# EAGLE schematic Wordclock-main-xtended (EAGLE 6.3)
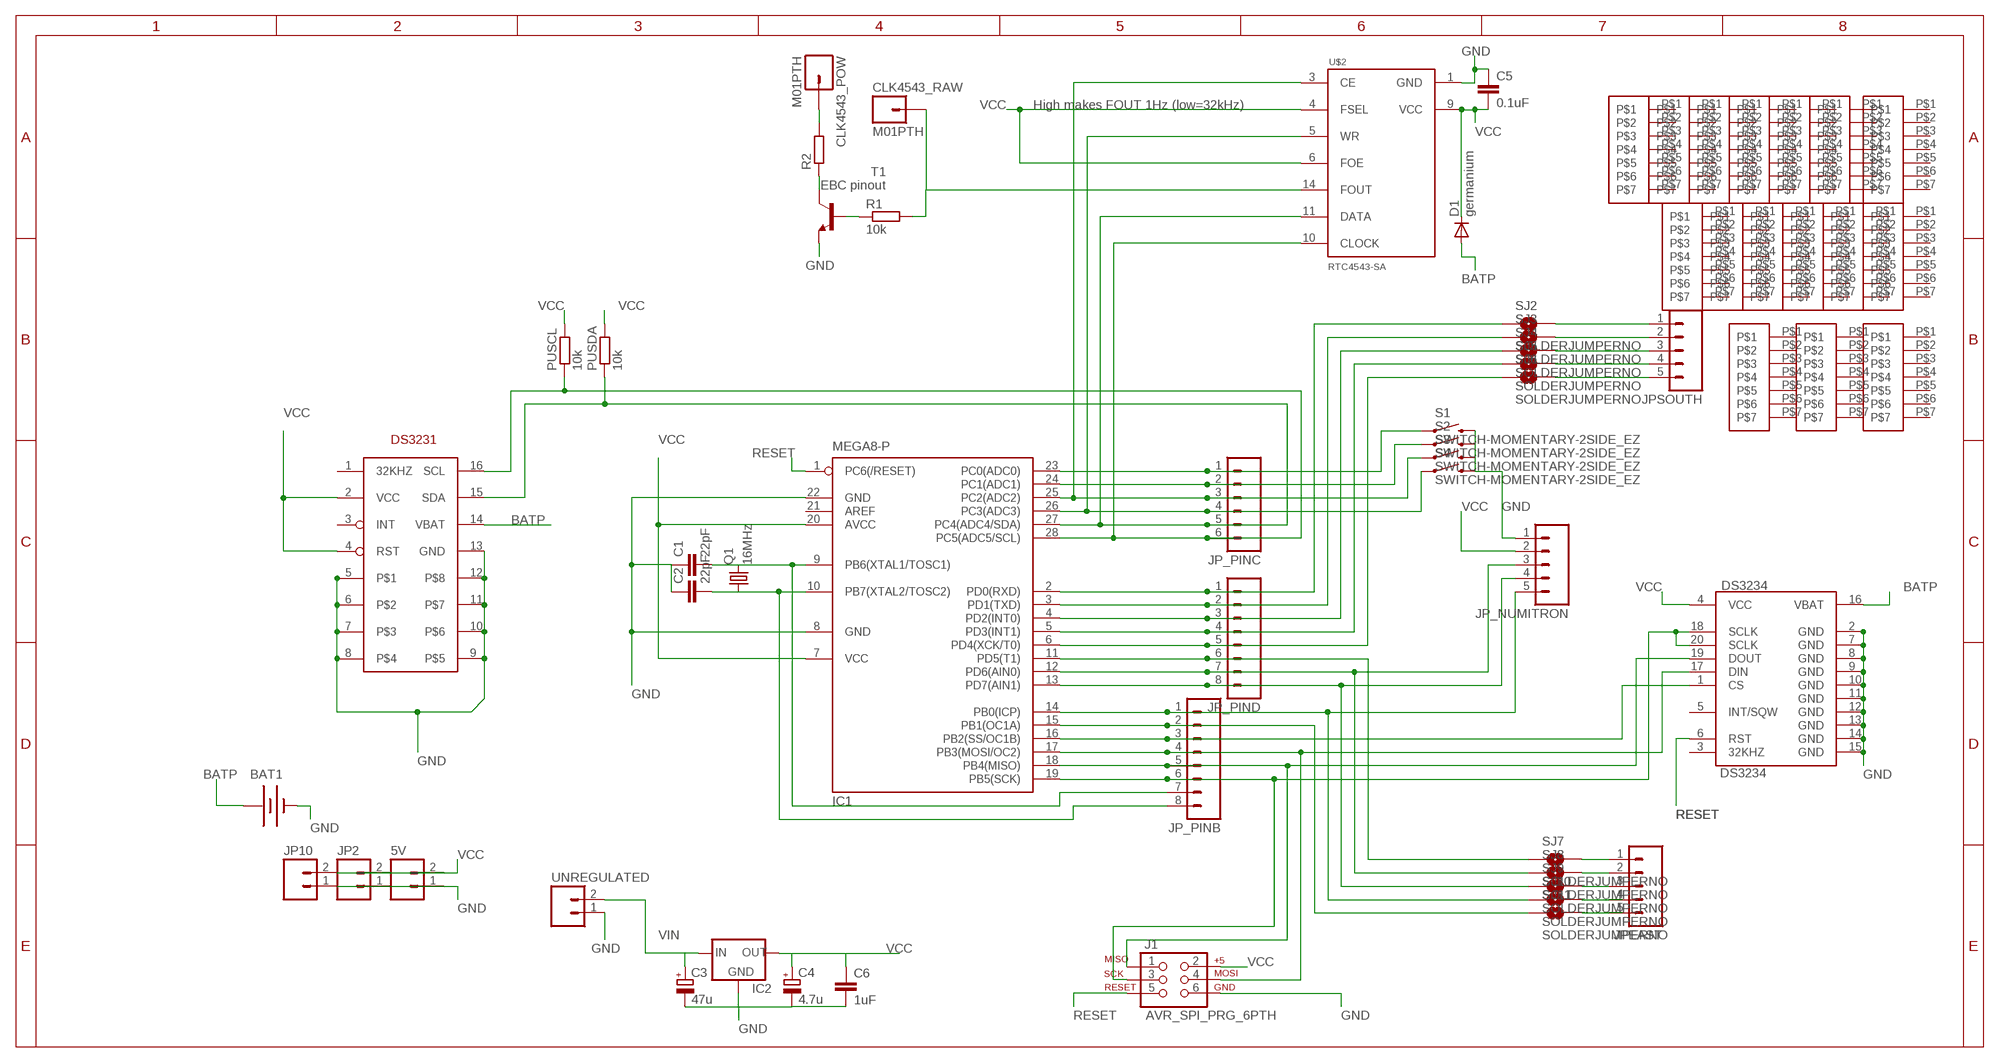
[diagram p0: schematic, sheet 1]

## Parts
5V  M02PTH3  [1X02_LONGPADS]
BAT1  BATTERY20PTH  [BATTCOM_20MM_PTH]
C1  22pF  C-EU025-024X044  [C025-024X044]
C2  22pF  C-EU025-024X044  [C025-024X044]
C3  47u  CPOL-EUE2,5-6E  [E2,5-6E]
C4  4.7u  CPOL-EUE2,5-6E  [E2,5-6E]
C5  0.1uF  C-EU025-024X044  [C025-024X044]
C6  1uF  C-EU025-024X044  [C025-024X044]
CLK4543_POW  M01PTH  [1X01]
CLK4543_RAW  M01PTH  [1X01]
D1  germanium  DIODE-D-7.5  [D-7.5]
DS3234  DS3234  [DS3234]
IC1  MEGA8-P  [DIL28-3]
IC2  V_REG_78XXSIDE  [78XXL]
J1  AVR_SPI_PRG_6PTH  [2X3]
JP1  M7_NOSILK  [M7_NOSILK]
JP2  M02PTH3  [1X02_LONGPADS]
JP3  M7_NOSILK  [M7_NOSILK]
JP4  M7_NOSILK  [M7_NOSILK]
JP5  M7_NOSILK  [M7_NOSILK]
JP6  M7_NOSILK  [M7_NOSILK]
JP7  M7_NOSILK  [M7_NOSILK]
JP8  M7_NOSILK  [M7_NOSILK]
JP9  M7_NOSILK  [M7_NOSILK]
JP10  M02PTH3  [1X02_LONGPADS]
JP_NUMITRON  M05PTH  [1X05]
JP_PINB  M081X08  [1X08]
JP_PINC  M06SIP  [1X06]
JP_PIND  M081X08  [1X08]
JPEAST  M05PTH  [1X05]
JPSOUTH  M05PTH  [1X05]
PUSCL  10k  R-EU_0204/5  [0204/5]
PUSDA  10k  R-EU_0204/5  [0204/5]
Q1  16MHz  CRYSTALHC49S  [HC49/S]
R1  10k  R-EU_0204/5  [0204/5]
R2  R-EU_0204/5  [0204/5]
S1  SWITCH-MOMENTARY-2SIDE_EZ  [TACTILE-PTH-SIDEEZ]
S2  SWITCH-MOMENTARY-2SIDE_EZ  [TACTILE-PTH-SIDEEZ]
S3  SWITCH-MOMENTARY-2SIDE_EZ  [TACTILE-PTH-SIDEEZ]
S4  SWITCH-MOMENTARY-2SIDE_EZ  [TACTILE-PTH-SIDEEZ]
SJ2  SOLDERJUMPERNO  [SJ_2S-NO]
SJ3  SOLDERJUMPERNO  [SJ_2S-NO]
SJ4  SOLDERJUMPERNO  [SJ_2S-NO]
SJ5  SOLDERJUMPERNO  [SJ_2S-NO]
SJ6  SOLDERJUMPERNO  [SJ_2S-NO]
SJ7  SOLDERJUMPERNO  [SJ_2S-NO]
SJ8  SOLDERJUMPERNO  [SJ_2S-NO]
SJ9  SOLDERJUMPERNO  [SJ_2S-NO]
SJ10  SOLDERJUMPERNO  [SJ_2S-NO]
SJ11  SOLDERJUMPERNO  [SJ_2S-NO]
T1  EBC pinout  -NPN-TO92-EBC  [TO92-EBC]
U$1  DS3231DS3231-SO16W  [SO16W]
U$2  RTC4543-SA  [SOP14]
U$3  M7_NOSILK  [M7_NOSILK]
U$4  M7_NOSILK  [M7_NOSILK]
U$5  M7_NOSILK  [M7_NOSILK]
U$6  M7_NOSILK  [M7_NOSILK]
U$7  M7_NOSILK  [M7_NOSILK]
U$8  M7_NOSILK  [M7_NOSILK]
U$9  M7_NOSILK  [M7_NOSILK]
U$10  M7_NOSILK  [M7_NOSILK]
UNREGULATED  M02PTH3  [1X02_LONGPADS]

## Nets
BATP: BAT1.1(+) D1.A DS3234.16(VBAT) U$1.14(VBAT)
GND: 5V.1 BAT1.2(-) C1.1 C2.1 C3.- C4.- C5.1 C6.2 DS3234.2(GND) DS3234.7(GND) DS3234.8(GND) DS3234.9(GND) DS3234.10(GND) DS3234.11(GND) DS3234.12(GND) DS3234.13(GND) DS3234.14(GND) DS3234.15(GND) IC1.8(GND) IC1.22(GND) IC2.GND J1.6 JP2.1 JP10.1 JP_NUMITRON.1 S1.2 S2.2 S3.2 S4.2 T1.E U$1.5 U$1.6 U$1.7 U$1.8 U$1.9 U$1.10 U$1.11 U$1.12 U$1.13(GND) U$2.1(GND) UNREGULATED.1
N$1: IC1.23(PC0(ADC0)) JP_PINC.1 S1.1
N$2: IC1.24(PC1(ADC1)) JP_PINC.2 S2.1
N$3: JPEAST.1 SJ7.2
N$4: C1.2 IC1.9(PB6(XTAL1/TOSC1)) JP_PINB.7 Q1.2
N$5: C2.2 IC1.10(PB7(XTAL2/TOSC2)) JP_PINB.8 Q1.1
N$6: DS3234.1(CS) IC1.16(PB2(SS/OC1B)) JP_PINB.3
N$7: IC1.25(PC2(ADC2)) JP_PINC.3 S3.1 U$2.3(CE)
N$8: JPEAST.2 SJ8.2
N$9: JPEAST.3 SJ9.2
N$10: JPEAST.4 SJ10.2
N$11: JPEAST.5 SJ11.2
N$12: DS3234.18(SCLK) DS3234.20(SCLK) IC1.19(PB5(SCK)) J1.3 JP_PINB.6
N$13: DS3234.19(DOUT) IC1.18(PB4(MISO)) J1.1 JP_PINB.5
N$14: DS3234.17(DIN) IC1.17(PB3(MOSI/OC2)) J1.4 JP_PINB.4
N$15: JPSOUTH.1 SJ2.2
N$16: JPSOUTH.2 SJ3.2
N$17: JPSOUTH.3 SJ4.2
N$18: JPSOUTH.4 SJ5.2
N$19: JPSOUTH.5 SJ6.2
N$20: IC1.2(PD0(RXD)) JP_PIND.1 SJ2.1
N$21: IC1.3(PD1(TXD)) JP_PIND.2 SJ3.1
N$22: IC1.4(PD2(INT0)) JP_PIND.3 SJ4.1
N$23: IC1.5(PD3(INT1)) JP_PIND.4 SJ5.1
N$24: IC1.6(PD4(XCK/T0)) JP_PIND.5 SJ6.1
N$25: IC1.15(PB1(OC1A)) JP_PINB.2 SJ11.1
N$26: IC1.14(PB0(ICP)) JP_NUMITRON.5 JP_PINB.1 SJ10.1
N$27: IC1.13(PD7(AIN1)) JP_NUMITRON.4 JP_PIND.8 SJ9.1
N$28: IC1.12(PD6(AIN0)) JP_NUMITRON.3 JP_PIND.7 SJ8.1
N$29: IC1.11(PD5(T1)) JP_PIND.6 SJ7.1
N$30: IC1.28(PC5(ADC5/SCL)) JP_PINC.6 PUSCL.1 U$1.16(SCL) U$2.10(CLOCK)
N$31: IC1.27(PC4(ADC4/SDA)) JP_PINC.5 PUSDA.1 U$1.15(SDA) U$2.11(DATA)
N$32: IC1.26(PC3(ADC3)) JP_PINC.4 S4.1 U$2.5(WR)
N$33: CLK4543_RAW.1 R1.2 U$2.14(FOUT)
N$34: R1.1 T1.B
N$35: R2.1 T1.C
N$36: CLK4543_POW.1 R2.2
RESET: DS3234.6(RST) IC1.1(PC6(/RESET)) J1.5
VCC: 5V.2 C4.+ C5.2 C6.1 D1.C DS3234.4(VCC) IC1.7(VCC) IC1.20(AVCC) IC2.OUT J1.2 JP2.2 JP10.2 JP_NUMITRON.2 PUSCL.2 PUSDA.2 U$1.2(VCC) U$1.4(RST) U$2.4(FSEL) U$2.6(FOE) U$2.9(VCC)
VIN: C3.+ IC2.IN UNREGULATED.2
Unconnected: DS3234.3(32KHZ) DS3234.5(INT/SQW) IC1.21(AREF) JP1.P$1 JP1.P$2 JP1.P$3 JP1.P$4 JP1.P$5 JP1.P$6 JP1.P$7 JP3.P$1 JP3.P$2 JP3.P$3 JP3.P$4 JP3.P$5 JP3.P$6 JP3.P$7 JP4.P$1 JP4.P$2 JP4.P$3 JP4.P$4 JP4.P$5 JP4.P$6 JP4.P$7 JP5.P$1 JP5.P$2 JP5.P$3 JP5.P$4 JP5.P$5 JP5.P$6 JP5.P$7 JP6.P$1 JP6.P$2 JP6.P$3 JP6.P$4 JP6.P$5 JP6.P$6 JP6.P$7 JP7.P$1 JP7.P$2 JP7.P$3 JP7.P$4 JP7.P$5 JP7.P$6 JP7.P$7 JP8.P$1 JP8.P$2 JP8.P$3 JP8.P$4 JP8.P$5 JP8.P$6 JP8.P$7 JP9.P$1 JP9.P$2 JP9.P$3 JP9.P$4 JP9.P$5 JP9.P$6 JP9.P$7 U$1.1(32KHZ) U$1.3(INT) U$3.P$1 U$3.P$2 U$3.P$3 U$3.P$4 U$3.P$5 U$3.P$6 U$3.P$7 U$4.P$1 U$4.P$2 U$4.P$3 U$4.P$4 U$4.P$5 U$4.P$6 U$4.P$7 U$5.P$1 U$5.P$2 U$5.P$3 U$5.P$4 U$5.P$5 U$5.P$6 U$5.P$7 U$6.P$1 U$6.P$2 U$6.P$3 U$6.P$4 U$6.P$5 U$6.P$6 U$6.P$7 U$7.P$1 U$7.P$2 U$7.P$3 U$7.P$4 U$7.P$5 U$7.P$6 U$7.P$7 U$8.P$1 U$8.P$2 U$8.P$3 U$8.P$4 U$8.P$5 U$8.P$6 U$8.P$7 U$9.P$1 U$9.P$2 U$9.P$3 U$9.P$4 U$9.P$5 U$9.P$6 U$9.P$7 U$10.P$1 U$10.P$2 U$10.P$3 U$10.P$4 U$10.P$5 U$10.P$6 U$10.P$7

## Notes on the sheet
- High makes FOUT 1Hz (low=32kHz)

## Library data of the parts
5V UNREGULATED = SparkFun:M02: Header 2 Standard 2-pin 0.1" header. Use with straight break away headers (SKU : PRT-00116), right angle break away headers (PRT-00553), swiss pins (PRT-00743), machine pins (PRT-00117), and female headers (PRT-00115). Molex polarized connector foot print use with SKU : PRT-08233 with associated crimp pins and housings.
BAT1 = SparkFun:BATTERY: Battery Holders Various common sizes : AA, AAA, 20mm coin cell and 12mm coin cell.
C1 C2 C5 C6 = resistor:C-EU: CAPACITOR, European symbol
C3 C4 = resistor:CPOL-EU: POLARIZED CAPACITOR, European symbol
CLK4543_POW CLK4543_RAW = SparkFun-Connectors:M01: Header 1 Standard 1-pin 0.1" header. Use with straight break away headers (SKU : PRT-00116), right angle break away headers (PRT-00553), swiss pins (PRT-00743), machine pins (PRT-00117), and female headers (PRT-00115).
D1 = diode:DIODE-: DIODE
DS3234 = SparkFun:DS3234: DS3234 Real Time Clock
IC1 = atmel:MEGA8-P: MICROCONTROLLER 8 Kbytes FLASH, 1 kbytes SRAM, 512 bytes EEPROM, USART, 4-channel 10 bit ADC, 2-channel 8 bit ADC Pin compatible with Atmega48, ATMega88, ATMega168 Source: avr.lbr; OC_FARNELL: unknown; OC_NEWARK: unknown
IC2 = SparkFun:V_REG_78XX: Voltage Regulator Standard 7805 5V regulator. IGO (Input Ground Output). Spark Fun Electronics SKU : COM-00107
J1 = SparkFun:AVR_SPI_PRG_6: AVR ISP 6 Pin This is the reduced ISP connector for AVR programming. Common on Arduino. This footprint will take up less PCB space and can be used with a 10-pin to 6-pin adapter such as SKU: BOB-08508
JP1 JP3-JP9 U$3-U$10 = kalshagar:M7_NOSILK
JP2 JP10 = SparkFun-Connectors:M02: Header 2 Standard 2-pin 0.1" header. Use with straight break away headers (SKU : PRT-00116), right angle break away headers (PRT-00553), swiss pins (PRT-00743), machine pins (PRT-00117), and female headers (PRT-00115). Molex polarized connector foot print use with SKU : PRT-08233 with associated crimp pins and housings.
JP_NUMITRON = SparkFun-Connectors:M05: Header 5 Standard 5-pin 0.1" header. Use with straight break away headers (SKU : PRT-00116), right angle break away headers (PRT-00553), swiss pins (PRT-00743), machine pins (PRT-00117), and female headers (PRT-00115). Molex polarized connector foot print use with SKU : PRT-08230 with associated crimp pins and housings.
JP_PINB JP_PIND = SparkFun-Connectors:M08: Header 8 Standard 8-pin 0.1" header. Use with straight break away headers (SKU : PRT-00116), right angle break away headers (PRT-00553), swiss pins (PRT-00743), machine pins (PRT-00117), and female headers (PRT-00115).
JP_PINC = SparkFun-Connectors:M06: Header 6 Standard 6-pin 0.1" header. Use with straight break away headers (SKU : PRT-00116), right angle break away headers (PRT-00553), swiss pins (PRT-00743), machine pins (PRT-00117), and female headers (PRT-00115). Molex polarized connector foot print use with SKU : PRT-08094 with associated crimp pins and housings. NOTES ON THE VARIANTS LOCK and LOCK_LONGPADS... This footprint was designed to help hold the alignment of a through-hole component (i.e. 6-pin header) while soldering it into place. You may notice that each hole has been shifted either up or down by 0.005 of an inch from it's more standard position (which is a perfectly straight line). This slight alteration caused the pins (the squares in the middle) to touch the edges of the holes. Because they are alternating, it causes a "brace" to hold the component in place. 0.005 has proven to be the perfect amount of "off-center" position when using our standard breakaway headers. Although looks a little odd when you look at the bare footprint, once you have a header in there, the alteration is very hard to notice. Also, if you push a header all the way into place, it is covered up entirely on the bottom side. This idea of altering the position of holes to aid alignment will be further integrated into the Sparkfun Library for other footprints. It can help hold any component with 3 or more connection pins.
JPEAST JPSOUTH = SparkFun:M05: Header 5 Standard 5-pin 0.1" header. Use with straight break away headers (SKU : PRT-00116), right angle break away headers (PRT-00553), swiss pins (PRT-00743), machine pins (PRT-00117), and female headers (PRT-00115). Molex polarized connector foot print use with SKU : PRT-08230 with associated crimp pins and housings.
PUSCL PUSDA R1 R2 = resistor:R-EU_: RESISTOR, European symbol
Q1 = crystal:CRYSTAL: CRYSTAL; OC_FARNELL: 1667008; OC_NEWARK: unknown
S1-S4 = SparkFun-Electromechanical:SWITCH-MOMENTARY-2: Various NO switches- pushbuttons, reed, etc
SJ2-SJ11 = SparkFun:SOLDERJUMPER: Solder Jumper Standard SMD solder jumper. Used to automate production. Two varients : Normally Open and Normally Closed are the same, but have different paste layers. NC will have a large amount of paste and should jumper during reflow.
T1 = transistor:*-NPN-: NPN Transistror BF959 corrected 2008.03.06
U$1 = kalshagar:DS3231: DS3231 with a WIDE package SO16W. About 1cm x 1cm.
U$2 = kalshagar:RTC4543-SA